# Altium schematic sheet EPM240T100C5N.SchDoc
size 420 x 297 mm; SheetNumber: 1; SheetTotal: 2
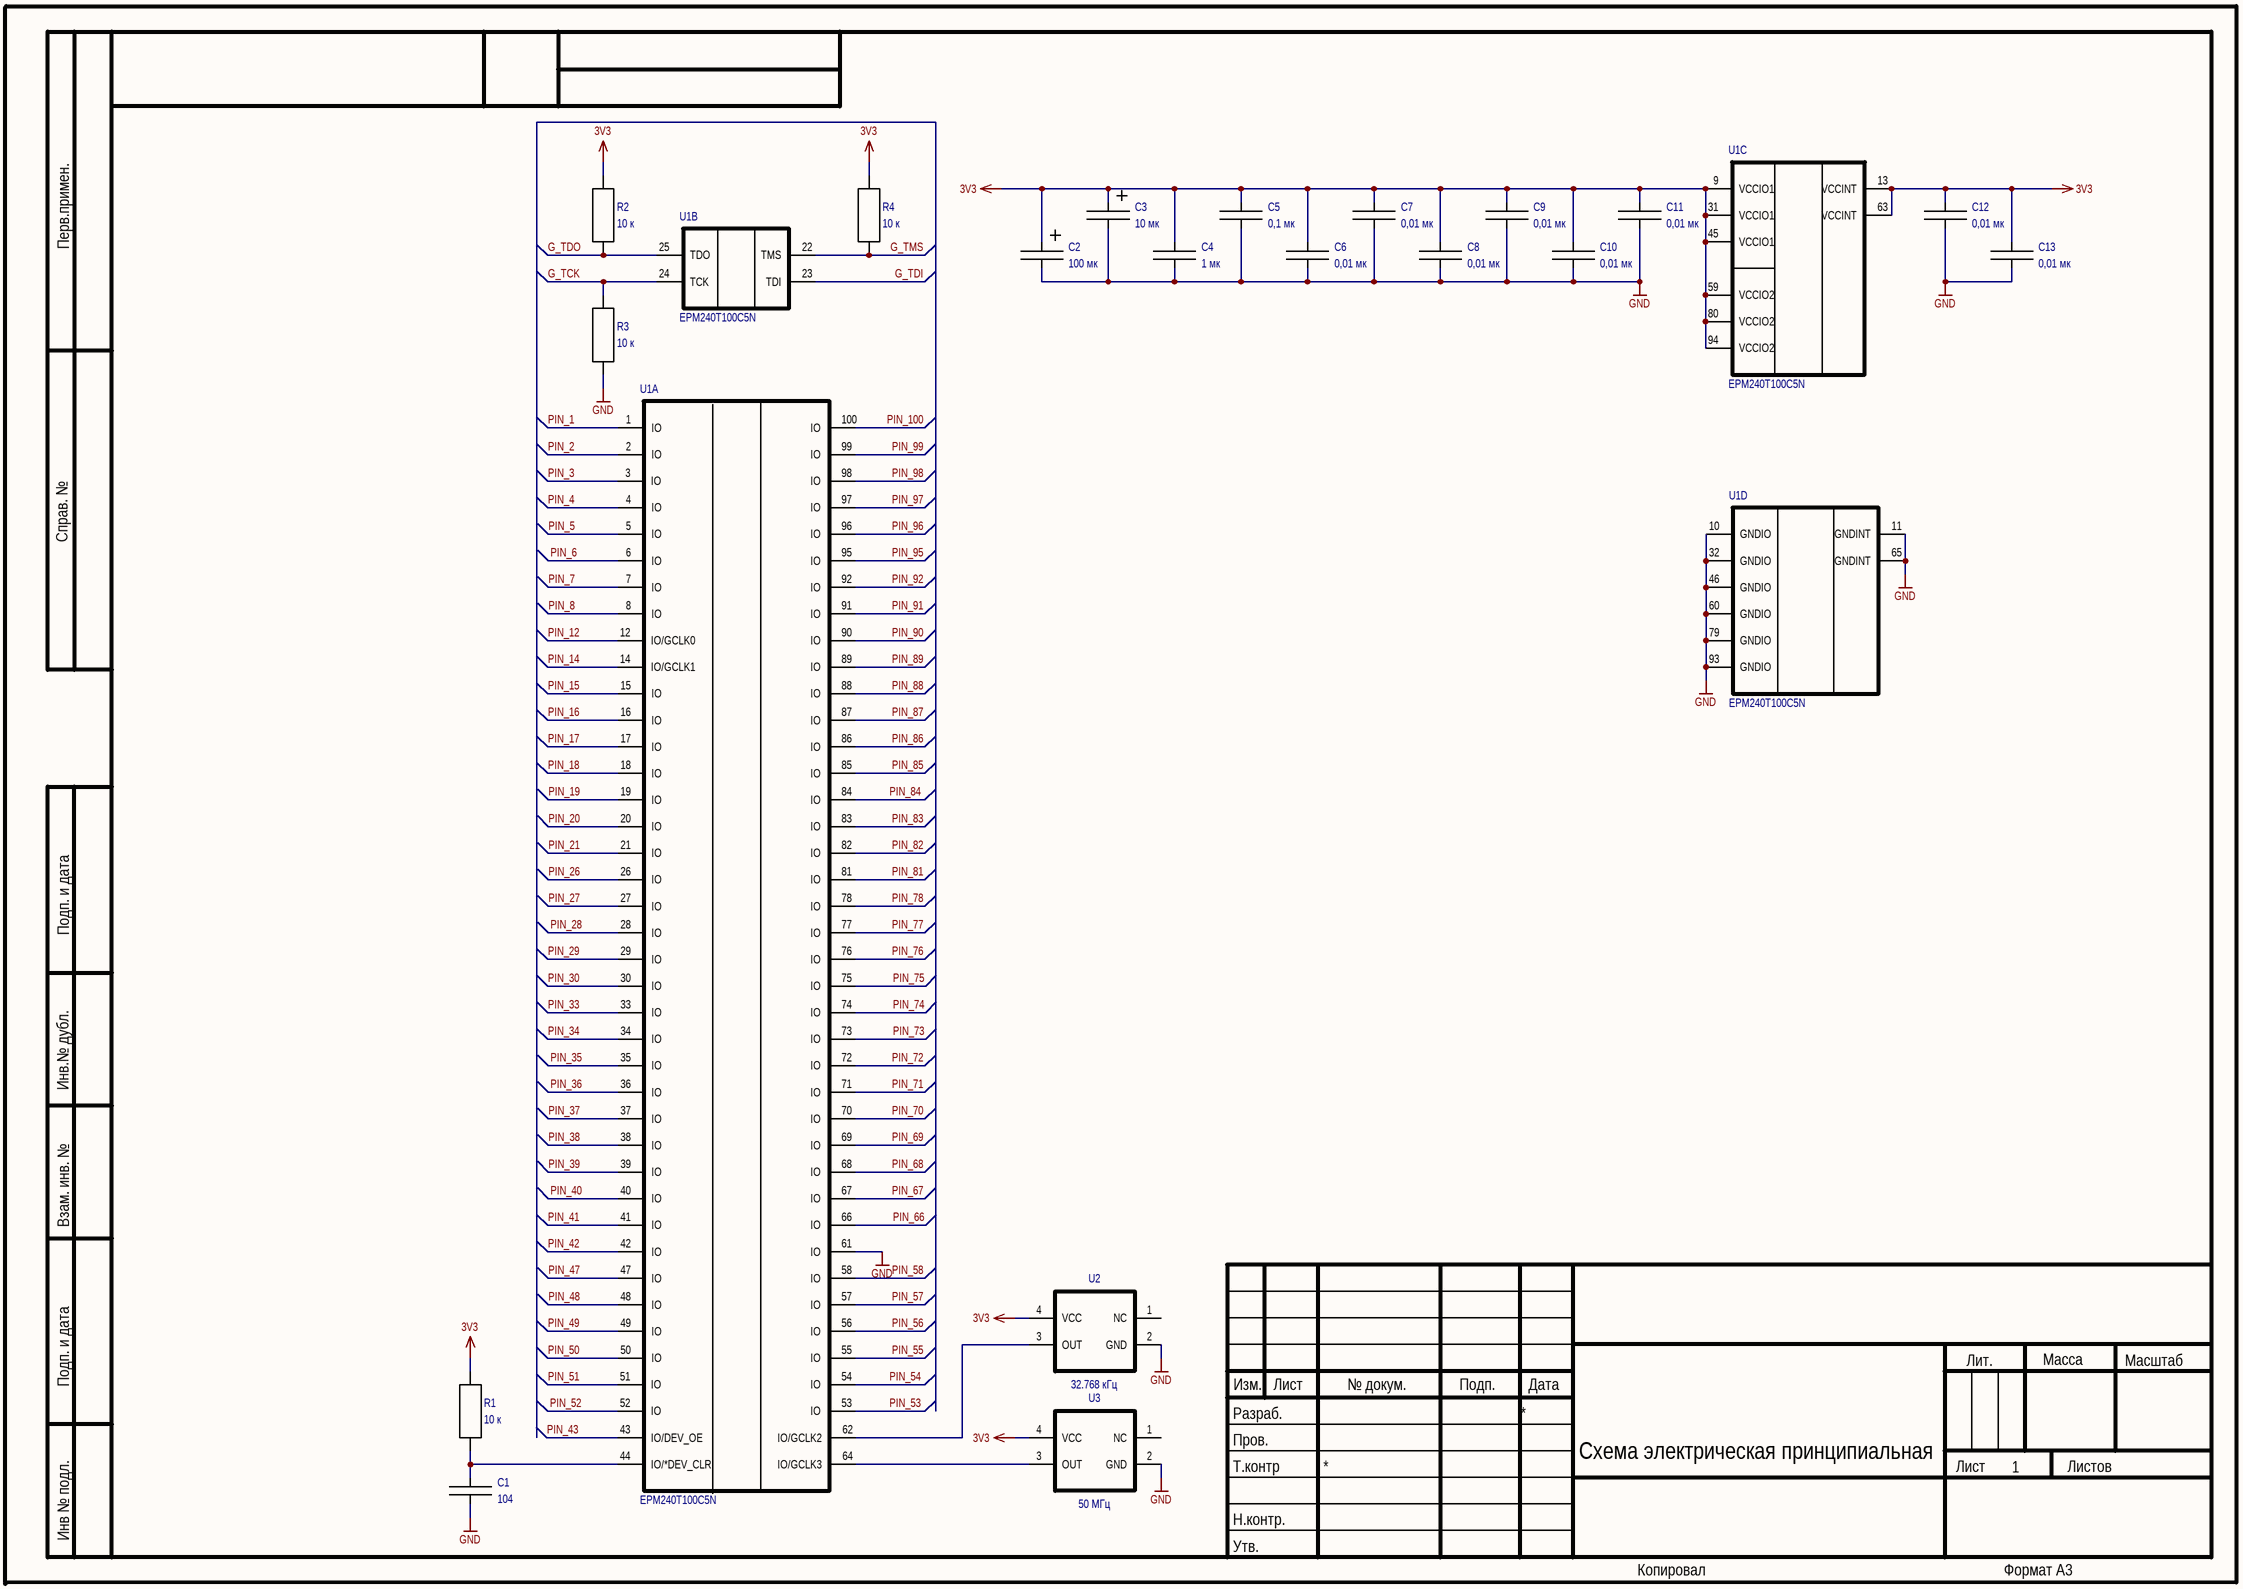
[diagram p0: EPM240T100C5N.SchDoc]

## Parts
C1  value 104  [K10-79_1.6_0.8(0603)]  (hidden comment: 0603)
C2  value 100 мк  [K53-68_3216(A)]  (hidden comment: A-case)
C3  value 10 мк  [K53-68_3216(A)]  (hidden comment: A-case)
C4  value 1 мк  [K10-79_2.0_1.25(0805)]  (hidden comment: 0603)
C5  value 0,1 мк  [K10-79_1.6_0.8(0603)]  (hidden comment: 0603)
C6  value 0,01 мк  [K10-79_1.6_0.8(0603)]  (hidden comment: 0603)
C7  value 0,01 мк  [K10-79_1.6_0.8(0603)]  (hidden comment: 0603)
C8  value 0,01 мк  [K10-79_1.6_0.8(0603)]  (hidden comment: 0603)
C9  value 0,01 мк  [K10-79_1.6_0.8(0603)]  (hidden comment: 0603)
C10  value 0,01 мк  [K10-79_1.6_0.8(0603)]  (hidden comment: 0603)
C11  value 0,01 мк  [K10-79_1.6_0.8(0603)]  (hidden comment: 0603)
C12  value 0,01 мк  [K10-79_1.6_0.8(0603)]  (hidden comment: 0603)
C13  value 0,01 мк  [K10-79_1.6_0.8(0603)]  (hidden comment: 0603)
R1  value 10 к  [RES 0603]
R2  value 10 к  [RES 0603]
R3  value 10 к  [RES 0603]
R4  value 10 к  [RES 0603]
U1  EPM240T100C5N  [100-TQFP_ALR]  (parts A,B,C,D of 4)
U2  value 32.768 кГц  [CB3LV3C50M0000]  (hidden comment: генератор)
U3  value 50 МГц  [CB3LV3C50M0000]  (hidden comment: генератор)

## Nets
3V3: C2.1 C3.1 C4.2 C5.2 C6.2 C7.2 C8.2 C9.2 C10.2 C11.2 C12.2 C13.2 R1.1 R2.1 R4.1 U1.9(VCCIO1) U1.13(VCCINT) U1.31(VCCIO1) U1.45(VCCIO1) U1.59(VCCIO2) U1.63(VCCINT) U1.80(VCCIO2) U1.94(VCCIO2) U2.4(VCC) U3.4(VCC)
GND: C1.1 C2.2 C3.2 C4.1 C5.1 C6.1 C7.1 C8.1 C9.1 C10.1 C11.1 C12.1 C13.1 R3.2 U1.10(GNDIO) U1.11(GNDINT) U1.32(GNDIO) U1.46(GNDIO) U1.60(GNDIO) U1.61(IO) U1.65(GNDINT) U1.79(GNDIO) U1.93(GNDIO) U2.2(GND) U3.2(GND)
G_TCK: R3.1 U1.24(TCK)
G_TDI: U1.23(TDI)
G_TDO: R2.2 U1.25(TDO)
G_TMS: R4.2 U1.22(TMS)
PIN_1: U1.1(IO)
PIN_2: U1.2(IO)
PIN_3: U1.3(IO)
PIN_4: U1.4(IO)
PIN_5: U1.5(IO)
PIN_6: U1.6(IO)
PIN_7: U1.7(IO)
PIN_8: U1.8(IO)
PIN_12: U1.12(IO/GCLK0)
PIN_14: U1.14(IO/GCLK1)
PIN_15: U1.15(IO)
PIN_16: U1.16(IO)
PIN_17: U1.17(IO)
PIN_18: U1.18(IO)
PIN_19: U1.19(IO)
PIN_20: U1.20(IO)
PIN_21: U1.21(IO)
PIN_26: U1.26(IO)
PIN_27: U1.27(IO)
PIN_28: U1.28(IO)
PIN_29: U1.29(IO)
PIN_30: U1.30(IO)
PIN_33: U1.33(IO)
PIN_34: U1.34(IO)
PIN_35: U1.35(IO)
PIN_36: U1.36(IO)
PIN_37: U1.37(IO)
PIN_38: U1.38(IO)
PIN_39: U1.39(IO)
PIN_40: U1.40(IO)
PIN_41: U1.41(IO)
PIN_42: U1.42(IO)
PIN_43: U1.43(IO/DEV_OE)
PIN_47: U1.47(IO)
PIN_48: U1.48(IO)
PIN_49: U1.49(IO)
PIN_50: U1.50(IO)
PIN_51: U1.51(IO)
PIN_52: U1.52(IO)
PIN_53: U1.53(IO)
PIN_54: U1.54(IO)
PIN_55: U1.55(IO)
PIN_56: U1.56(IO)
PIN_57: U1.57(IO)
PIN_58: U1.58(IO)
PIN_66: U1.66(IO)
PIN_67: U1.67(IO)
PIN_68: U1.68(IO)
PIN_69: U1.69(IO)
PIN_70: U1.70(IO)
PIN_71: U1.71(IO)
PIN_72: U1.72(IO)
PIN_73: U1.73(IO)
PIN_74: U1.74(IO)
PIN_75: U1.75(IO)
PIN_76: U1.76(IO)
PIN_77: U1.77(IO)
PIN_78: U1.78(IO)
PIN_81: U1.81(IO)
PIN_82: U1.82(IO)
PIN_83: U1.83(IO)
PIN_84: U1.84(IO)
PIN_85: U1.85(IO)
PIN_86: U1.86(IO)
PIN_87: U1.87(IO)
PIN_88: U1.88(IO)
PIN_89: U1.89(IO)
PIN_90: U1.90(IO)
PIN_91: U1.91(IO)
PIN_92: U1.92(IO)
PIN_95: U1.95(IO)
PIN_96: U1.96(IO)
PIN_97: U1.97(IO)
PIN_98: U1.98(IO)
PIN_99: U1.99(IO)
PIN_100: U1.100(IO)
NetC1_2: C1.2 R1.2 U1.44(IO/*DEV_CLR)
NetU1_62: U1.62(IO/GCLK2) U2.3(OUT)
NetU1_64: U1.64(IO/GCLK3) U3.3(OUT)

Not connected (* = marked no-connect by the designer): U2 1(NC); U3 1(NC)

## Notes on the sheet
- Перв.примен.
- Справ. №
- Подп. и дата
- Инв.№ дубл.
- Взам. инв. №
- Изм.
- Лист
- № докум.
- Подп.
- Дата
- Лит.
- Масса
- Масштаб
- Пров.
- Т.контр
- Разраб.
- Схема электрическая принципиальная
- 1
- Листов
- Инв № подл.
- Н.контр.
- Утв.
- Копировал
- Формат А3

## Library data of the parts
C1 C4-C13 = C: Company: *; PartNumber: *; Tolerance: *; Voltage: *; Type: *; Package: 0603
C2 C3 = C+: Company: *; Tolerance: *; Voltage: *; Type: *; PartNumber: *; Package: A-case
R1-R4 = R_1: Company: *; PartNumber: *; Package: *; Tolerance: *
U2 U3 = генератор: PartNumber: MQ-12.000-18; Company: Mercury; Package: 0705